# EAGLE design double_layer (EAGLE 8.1.0)
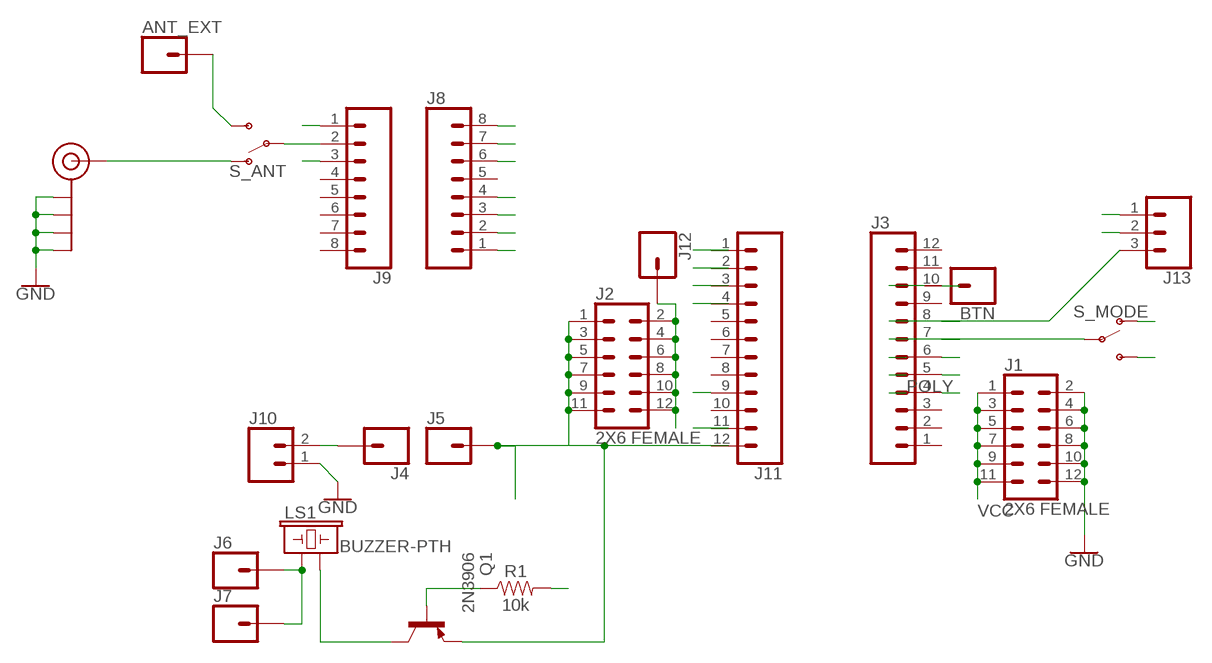
[diagram p0: schematic, sheet 1]

## Parts
ANT_EXT  CONN_01  [1X01]
BTN  CONN_01  [1X01]
J1  2X6 FEMALE  CONN_06X2PTH_FEMALE  [2X6]
J2  2X6 FEMALE  CONN_06X2PTH_FEMALE  [2X6]
J3  CONN_12  [1X12]
J4  CONN_01  [1X01]
J5  CONN_01  [1X01]
J6  CONN_01  [1X01]
J7  CONN_01  [1X01]
J8  CONN_08"  [1X08]
J9  CONN_08"  [1X08]
J10  CONN_02JST-PTH-2  [JST-2-PTH]
J11  CONN_12  [1X12]
J12  CONN_01  [1X01]
J13  CONN_03JST-PTH  [JST-3-PTH]
J$1  SMA_EDGE  [SMA-EDGE]
LS1  BUZZER-PTH  [BUZZER-12MM]
Q1  2N3906  [TO92]
R1  10k  10KOHM-HORIZ-1/6W-5%  [AXIAL-0.3]
S_ANT  SWITCH-SPDT-PTH-11.6X4.0MM  [SWITCH_SPDT_PTH_11.6X4.0MM]
S_MODE  SWITCH-SPDT-PTH-11.6X4.0MM  [SWITCH_SPDT_PTH_11.6X4.0MM]

## Nets
7: J3.7 S_MODE.2(P)
8: J3.8
10: BTN.1 J3.10
ANT: J9.2 S_ANT.2(P)
DIO0: J3.5 J8.6
GND: J1.2 J1.4 J1.6 J1.8 J1.10 J1.12 J2.2 J2.4 J2.6 J2.8 J2.10 J2.12 J3.4 J8.7 J9.1 J9.3 J10.1 J11.11 J12.1 J13.2 J$1.GND@0(GND) J$1.GND@1(GND) J$1.GND@2(GND) J$1.GND@3(GND) S_MODE.3(S)
MISO: J8.1 J11.3
MOSI: J8.2 J11.2
N$1: LS1.- Q1.1(C)
N$6: Q1.2(B) R1.P$1
N$7: ANT_EXT.1 S_ANT.3(S)
N$8: J$1.SIG(SIGNAL) S_ANT.1(O)
N$10: J4.1 J10.2
N$11: J6.1 J7.1 LS1.+
NSS: J8.4 J11.1
RAW: J2.1 J2.3 J2.5 J2.7 J2.9 J2.11 J5.1 J11.12 Q1.3(E)
SCK: J8.3 J11.4
SPKR: J3.6 R1.P$2
VCC: J1.1 J1.3 J1.5 J1.7 J1.9 J1.11 J8.8 J11.9 J13.1 S_MODE.1(O)
Unconnected: J3.1 J3.2 J3.3 J3.9 J3.11 J3.12 J8.5 J9.4 J9.5 J9.6 J9.7 J9.8 J11.5 J11.6 J11.7 J11.8 J11.10 J13.3

## Library data of the parts
ANT_EXT BTN J4-J7 J12 = SparkFun-Connectors:CONN_01: Single connection point. Often used as Generic Header-pin footprint for 0.1 inch spaced/style header connections On any of the 0.1 inch spaced packages, you can populate with these: Break Away Headers - Straight <https://www.sparkfun.com/products/116> (PRT-00116) Break Away Male Headers - Right Angle <https://www.sparkfun.com/products/553> (PRT-00553) Female Headers <https://www.sparkfun.com/products/115> (PRT-00115) Break Away Headers - Machine Pin <https://www.sparkfun.com/products/117> (PRT-00117) Break Away Female Headers - Swiss Machine Pin <https://www.sparkfun.com/products/743> (PRT-00743) This device is also useful as a general connection point to wire up your design to another part of your project. Our various solder wires solder well into these plated through hole pads. Hook-Up Wire - Assortment (Stranded, 22 AWG) <https://www.sparkfun.com/products/11375> (PRT-11375) Hook-Up Wire - Assortment (Solid Core, 22 AWG) <https://www.sparkfun.com/products/11367> (PRT-11367) View the entire wire category on our website here <https://www.sparkfun.com/categories/141> Special notes: SMTSO-256-ET is a "flush mount" nut for a 4-40 screw. We mostly use this on specialty testbeds; it is a nice way to connect hardware to your PCB at an adjustable hieght. Also note, the SNAP packages are for using a snappable style connector. We sell a baggie of snaps and they are also used on two LilyPad designs: Snap Assortment - 30 pack (male and female) <https://www.sparkfun.com/products/11347> (DEV-11347) LilyPad Arduino SimpleSnap <https://www.sparkfun.com/products/10941> (DEV-10941) LilyPad SimpleSnap Protoboard <https://www.sparkfun.com/products/10940> (DEV-10940)
J1 J2 = SparkFun-Connectors:CONN_06X2: Multi connection point. Often used as Generic Header-pin footprint for 0.1 inch spaced/style header connections On any of the 0.1 inch spaced packages, you can populate with these: Break Away Headers - Straight <https://www.sparkfun.com/products/116> (PRT-00116) Break Away Male Headers - Right Angle <https://www.sparkfun.com/products/553> (PRT-00553) Female Headers <https://www.sparkfun.com/products/115> (PRT-00115) Break Away Headers - Machine Pin <https://www.sparkfun.com/products/117> (PRT-00117) Break Away Female Headers - Swiss Machine Pin <https://www.sparkfun.com/products/743> (PRT-00743); PROD_ID: CONN-12423
J3 J11 = SparkFun-Connectors:CONN_12: Multi connection point. Often used as Generic Header-pin footprint for 0.1 inch spaced/style header connections On any of the 0.1 inch spaced packages, you can populate with these: Break Away Headers - Straight <https://www.sparkfun.com/products/116> (PRT-00116) Break Away Male Headers - Right Angle <https://www.sparkfun.com/products/553> (PRT-00553) Female Headers <https://www.sparkfun.com/products/115> (PRT-00115) Break Away Headers - Machine Pin <https://www.sparkfun.com/products/117> (PRT-00117) Break Away Female Headers - Swiss Machine Pin <https://www.sparkfun.com/products/743> (PRT-00743) For SCREWTERMINALS and SPRING TERMINALS visit here: Screw Terimnals on SparkFun.com <https://www.sparkfun.com/search/results?term=Screw+Terminals> (5mm/3.5mm/2.54mm spacing) This device is also useful as a general connection point to wire up your design to another part of your project. Our various solder wires solder well into these plated through hole pads. Hook-Up Wire - Assortment (Stranded, 22 AWG) <https://www.sparkfun.com/products/11375> (PRT-11375) Hook-Up Wire - Assortment (Solid Core, 22 AWG) <https://www.sparkfun.com/products/11367> (PRT-11367) View the entire wire category on our website here <https://www.sparkfun.com/categories/141> Special notes: Molex polarized connector foot print use with SKU : PRT-08231 with associated crimp pins and housings. 1MM SMD Version SKU: PRT-10208 NOTES ON THE VARIANTS LOCK and LOCK_LONGPADS... This footprint was designed to help hold the alignment of a through-hole component (i.e. 6-pin header) while soldering it into place. You may notice that each hole has been shifted either up or down by 0.005 of an inch from it's more standard position (which is a perfectly straight line). This slight alteration caused the pins (the squares in the middle) to touch the edges of the holes. Because they are alternating, it causes a "brace" to hold the component in place. 0.005 has proven to be the perfect amount of "off-center" position when using our standard breakaway headers. Although looks a little odd when you look at the bare footprint, once you have a header in there, the alteration is very hard to notice. Also,if you push a header all the way into place, it is covered up entirely on the bottom side.
J8 J9 = SparkFun-Connectors:CONN_08: Multi connection point. Often used as Generic Header-pin footprint for 0.1 inch spaced/style header connections On any of the 0.1 inch spaced packages, you can populate with these: Break Away Headers - Straight <https://www.sparkfun.com/products/116> (PRT-00116) Break Away Male Headers - Right Angle <https://www.sparkfun.com/products/553> (PRT-00553) Female Headers <https://www.sparkfun.com/products/115> (PRT-00115) Break Away Headers - Machine Pin <https://www.sparkfun.com/products/117> (PRT-00117) Break Away Female Headers - Swiss Machine Pin <https://www.sparkfun.com/products/743> (PRT-00743) Arduino Stackable Header - 8 Pin <https://www.sparkfun.com/products/9279> (PRT-09279) For SCREWTERMINALS and SPRING TERMINALS visit here: Screw Terimnals on SparkFun.com <https://www.sparkfun.com/search/results?term=Screw+Terminals> (5mm/3.5mm/2.54mm spacing) This device is also useful as a general connection point to wire up your design to another part of your project. Our various solder wires solder well into these plated through hole pads. Hook-Up Wire - Assortment (Stranded, 22 AWG) <https://www.sparkfun.com/products/11375> (PRT-11375) Hook-Up Wire - Assortment (Solid Core, 22 AWG) <https://www.sparkfun.com/products/11367> (PRT-11367) View the entire wire category on our website here <https://www.sparkfun.com/categories/141> Special notes: Molex polarized connector foot print use with SKU : PRT-08231 with associated crimp pins and housings. 1MM SMD Version SKU: PRT-10208 NOTES ON THE VARIANTS LOCK and LOCK_LONGPADS... This footprint was designed to help hold the alignment of a through-hole component (i.e. 6-pin header) while soldering it into place. You may notice that each hole has been shifted either up or down by 0.005 of an inch from it's more standard position (which is a perfectly straight line). This slight alteration caused the pins (the squares in the middle) to touch the edges of the holes. Because they are alternating, it causes a "brace" to hold the component in place. 0.005 has proven to be the perfect amount of "off-center" position when using our standard breakaway headers. Although looks a little odd when you look at the bare footprint, once you have a header in there, the alteration is very hard to notice. Also,if you push a header all the way into place, it is covered up entirely on the bottom side.; PROD_ID: CONN-08438
J10 = SparkFun-Connectors:CONN_02: Multi connection point. Often used as Generic Header-pin footprint for 0.1 inch spaced/style header connections On any of the 0.1 inch spaced packages, you can populate with these: Break Away Headers - Straight <https://www.sparkfun.com/products/116> (PRT-00116) Break Away Male Headers - Right Angle <https://www.sparkfun.com/products/553> (PRT-00553) Female Headers <https://www.sparkfun.com/products/115> (PRT-00115) Break Away Headers - Machine Pin <https://www.sparkfun.com/products/117> (PRT-00117) Break Away Female Headers - Swiss Machine Pin <https://www.sparkfun.com/products/743> (PRT-00743) For SCREWTERMINALS and SPRING TERMINALS visit here: Screw Terimnals on SparkFun.com <https://www.sparkfun.com/search/results?term=Screw+Terminals> (5mm/3.5mm/2.54mm spacing) This device is also useful as a general connection point to wire up your design to another part of your project. Our various solder wires solder well into these plated through hole pads. Hook-Up Wire - Assortment (Stranded, 22 AWG) <https://www.sparkfun.com/products/11375> (PRT-11375) Hook-Up Wire - Assortment (Solid Core, 22 AWG) <https://www.sparkfun.com/products/11367> (PRT-11367) View the entire wire category on our website here <https://www.sparkfun.com/categories/141> Special notes: Molex polarized connector foot print use with: PRT-08233 with associated crimp pins and housings. 2.54_SCREWTERM for use with PRT-10571. 3.5mm Screw Terminal footprints for PRT-08084 5mm Screw Terminal footprints for use with PRT-08432; PROD_ID: CONN-09863; SKU: PRT-09914
J13 = SparkFun-Connectors:CONN_03: Multi connection point. Often used as Generic Header-pin footprint for 0.1 inch spaced/style header connections On any of the 0.1 inch spaced packages, you can populate with these: Break Away Headers - Straight <https://www.sparkfun.com/products/116> (PRT-00116) Break Away Male Headers - Right Angle <https://www.sparkfun.com/products/553> (PRT-00553) Female Headers <https://www.sparkfun.com/products/115> (PRT-00115) Break Away Headers - Machine Pin <https://www.sparkfun.com/products/117> (PRT-00117) Break Away Female Headers - Swiss Machine Pin <https://www.sparkfun.com/products/743> (PRT-00743) Stackable Header - 3 Pin (Female, 0.1") <https://www.sparkfun.com/products/13875> (PRT-13875) For SCREWTERMINALS and SPRING TERMINALS visit here: Screw Terimnals on SparkFun.com <https://www.sparkfun.com/search/results?term=Screw+Terminals> (5mm/3.5mm/2.54mm spacing) This device is also useful as a general connection point to wire up your design to another part of your project. Our various solder wires solder well into these plated through hole pads. Hook-Up Wire - Assortment (Stranded, 22 AWG) <https://www.sparkfun.com/products/11375> (PRT-11375) Hook-Up Wire - Assortment (Solid Core, 22 AWG) <https://www.sparkfun.com/products/11367> (PRT-11367) View the entire wire category on our website here <https://www.sparkfun.com/categories/141> Special notes: Molex polarized connector foot print use with SKU : PRT-08232 with associated crimp pins and housings.; PROD_ID: WIRE-10037; SF_ID: PRT-09915
J$1 = SparkFun-Retired:SMA_EDGE: SMA Antenna Connector End launch SMA connector. The paste layer has been removed so that the connector can be hand soldered onto the board after reflow.
LS1 = SparkFun-Electromechanical:BUZZER: Buzzer Small round buzzers that operate around the audible 2kHz range. You can use these as speakers to create simple music or user interfaces. Variant Overview: PTH - Mini Speaker - PC Mount 12mm 2.048kHz <https://www.sparkfun.com/products/7950> PTH_KIT - Mini Speaker - PC Mount 12mm 2.048kHz <https://www.sparkfun.com/products/7950> KIT simplifies soldering by adding stop mask to one side of the pads. PTH_NO_SILK - Mini Speaker - PC Mount 12mm 2.048kHz <https://www.sparkfun.com/products/7950> No silkscreen indicator of buzzer outline. PTH_KIT_NO_SILK - Mini Speaker - PC Mount 12mm 2.048kHz <https://www.sparkfun.com/products/7950> KIT package w/o silkscreen SMD - Buzzer Audio Magnetic (CCV-084B16) SMD buzzer used on, e.g. the LilyPad Buzzer <https://www.sparkfun.com/products/8463> and RFID USB Reader <https://www.sparkfun.com/products/9963>. SMD_KIT - Buzzer Audio Magnetic (CCV-084B16) SMD Buzzer with elongated pins to make soldering easier. Used on the SparkFun Simon Says - Surface Mount Soldering Kit <https://www.sparkfun.com/products/10935>.; PROD_ID: COMP-08253; SF_SKU: COM-07950
Q1 = transistor-pnp:2N3906: PNP Transistor
R1 = SparkFun-Resistors:10KOHM: 10kΩ resistor A resistor is a passive two-terminal electrical component that implements electrical resistance as a circuit element. Resistors act to reduce current flow, and, at the same time, act to lower voltage levels within circuits. - Wikipedia; PROD_ID: RES-08375
S_ANT S_MODE = SparkFun-Switches:SWITCH-SPDT: Single Pole, Double Throw (SPDT) Switch Single-pole, double-throw (SPDT) switch. Variant Overview SMD-AYZ0202 Surface Mount DPDT Switch <https://www.sparkfun.com/products/597> (COM-00597) Used on e.g. LilyPad Arduino USB - ATmega32U4 Board <https://www.sparkfun.com/products/12049> PTH-11.6X4.0MM SPDT Mini Power Switch <https://www.sparkfun.com/products/102> (COM-00102) Used on e.g. SparkFun Simon Says - Through-Hole Soldering Kit <https://www.sparkfun.com/products/10547> (KIT-10547) PTH-11.6X4.0MM-KIT KIT version of SPDT Mini Power Switch - Simplifies soldering by removing tStop of switch pins - only one side can be soldered. PTH-11.6X4.0MM-LOCK LOCK version of SPDT Mini Power Switch - Offset pins hold switch in place for easier soldering. SMD-RIGHT-ANGLE Surface Mount Right Angle Switch <https://www.sparkfun.com/products/10860> (COM-10860) Used on e.g. SparkFun ESP8266 Thing <https://www.sparkfun.com/products/13231>; PROD_ID: SWCH-08261; SF_SKU: COM-00102

## Board
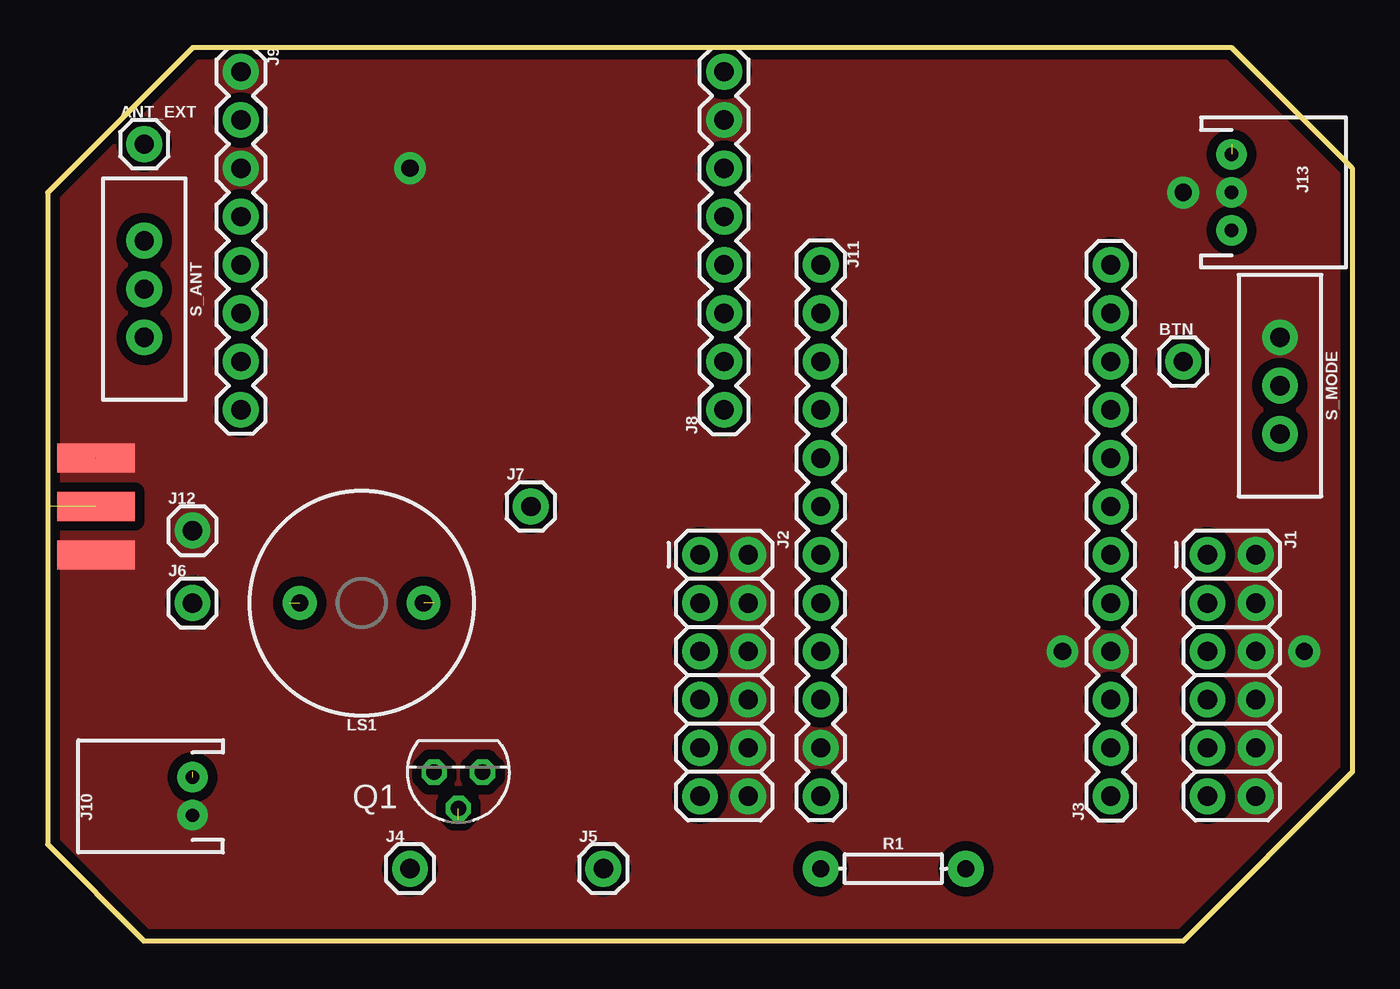
[diagram p1: board, top side]
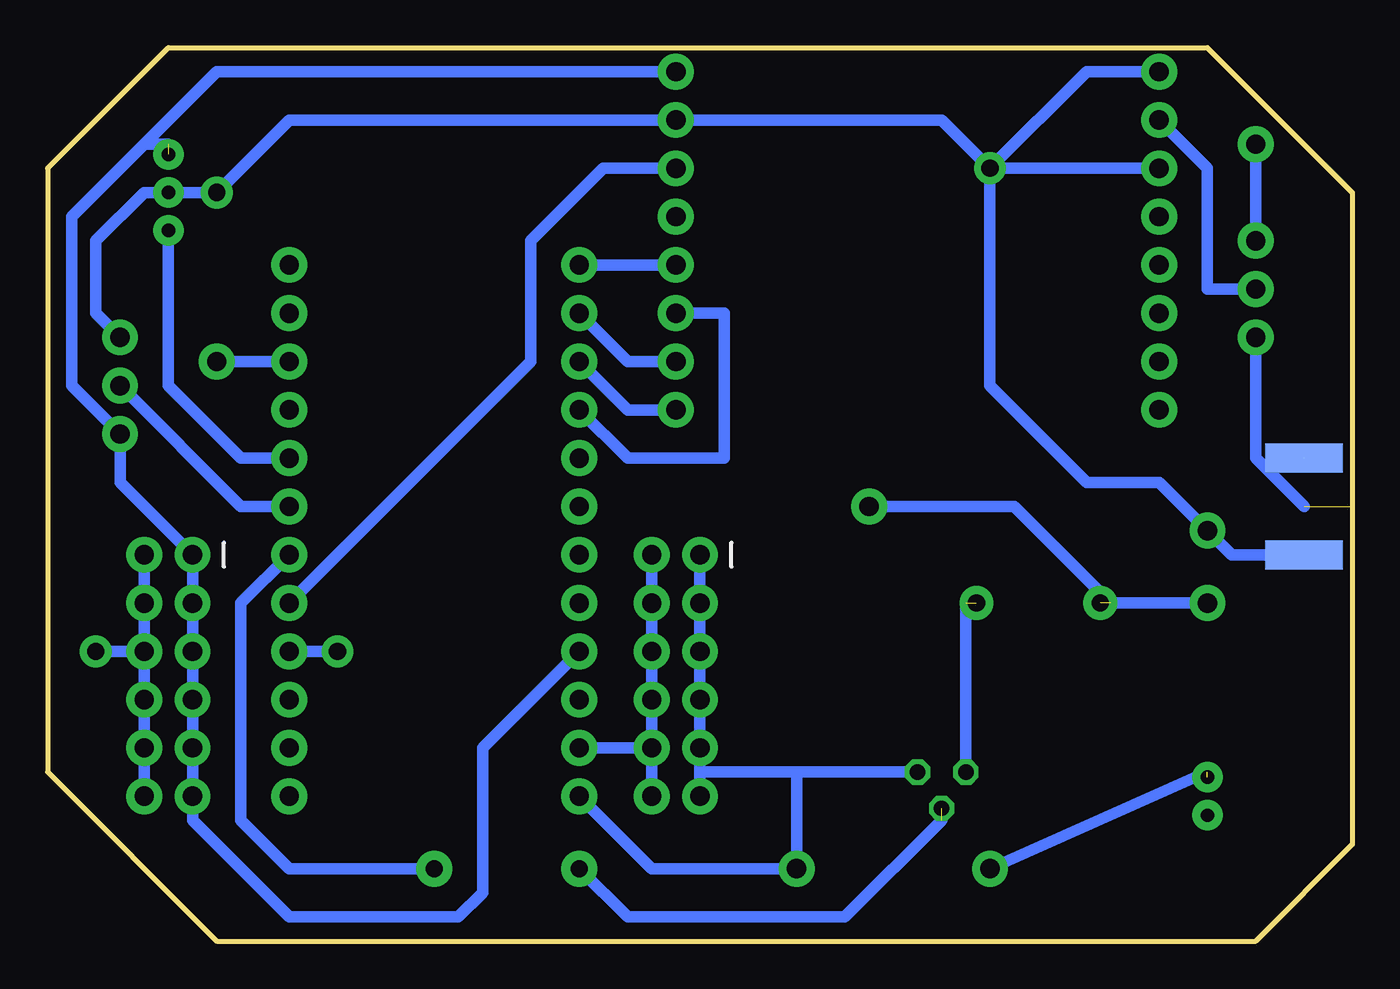
[diagram p2: board, bottom side, seen from below]

Size 68.58 x 46.99 mm. Coordinates in mm from the lower left corner, seen from the top.
Outline: 68.58,8.89 59.69,0 5.08,0 0,5.08 0,39.37 7.62,46.99 62.23,46.99 68.58,40.64 68.58,8.89
Copper layers (1*16): Top 0.035mm / dielectric 1.5mm / Bottom 0.035mm
Design rules "default *": minimum track width 10mil, minimum drill 24mil, track to track 8mil, track to pad 8mil, pad to pad 8mil, via to via 8mil, smd to smd 8mil, copper to edge 10mil, drill to drill 8mil, minimum pad ring 10mil, minimum via ring 8mil, stop-mask expansion 4mil, vias tented up to drill 0mil, thermal gap 10mil

### Footprints (pad centres in the part's own frame; a part is rotated, then mirrored left to right if it is on the bottom)
1X01 = drill 1.016 pad 1.88: 1 0,0
2X6 = drill 1.016 pad 1.88: 1 0,0; 2 0,2.54; 3 2.54,0; 4 2.54,2.54; 5 5.08,0; 6 5.08,2.54; 7 7.62,0; 8 7.62,2.54; 9 10.16,0; 10 10.16,2.54; 11 12.7,0; 12 12.7,2.54
1X12 = drill 1.016 pad 1.88: 1 0,0; 2 2.54,0; 3 5.08,0; 4 7.62,0; 5 10.16,0; 6 12.7,0; 7 15.24,0; 8 17.78,0; 9 20.32,0; 10 22.86,0; 11 25.4,0; 12 27.94,0
1X08 = drill 1.016 pad 1.88: 1 0,0; 2 2.54,0; 3 5.08,0; 4 7.62,0; 5 10.16,0; 6 12.7,0; 7 15.24,0; 8 17.78,0
JST-2-PTH = drill 0.7 pad 1.6: 1 -1,0; 2 1,0
JST-3-PTH = drill 0.7 pad 1.6: 1 -2,0; 2 0,0; 3 2,0
SMA-EDGE = smd 1.524 x 4.064: GND@0 0,0; GND@1 5.08,0; SIG 2.54,0 | smd 1.524 x 4.064 bottom: GND@2 0,0; GND@3 5.08,0
BUZZER-12MM = drill 0.9 pad 1.778: + 3.25,0; - -3.25,0
TO92 = drill 0.813 octagon: 1 1.27,0; 2 0,1.905; 3 -1.27,0
AXIAL-0.3 = drill 0.9 pad 1.88: P$1 -3.81,0; P$2 3.81,0
SWITCH_SPDT_PTH_11.6X4.0MM = drill 1.016 pad 1.88: 1 0,2.54; 2 0,0; 3 0,-2.54

### Placement (x,y rotation side)
ANT_EXT  5.08,41.91 0 top
BTN  59.69,30.48 0 top
J1  60.96,20.32 270 top
J2  34.29,20.32 270 top
J3  55.88,7.62 90 top
J4  19.05,3.81 0 top
J5  29.21,3.81 0 top
J6  7.62,17.78 0 top
J7  25.4,22.86 0 top
J8  35.56,27.94 90 top
J9  10.16,45.72 270 top
J10  7.62,7.62 90 top
J11  40.64,35.56 270 top
J12  7.62,21.59 0 top
J13  62.23,39.37 270 top
J$1  2.54,20.32 90 top
LS1  16.51,17.78 180 top
Q1  21.59,8.89 180 top
R1  44.45,3.81 0 top
S_ANT  5.08,34.29 180 top
S_MODE  64.77,29.21 180 top

### Tracks (layer width: path | path; a pad name or v marks a point on that pad's centre or on a via)
7
  Bottom 0.61: J3.7 58.42,22.86 S_MODE.2
8
  Bottom 0.61: J3.8 58.42,25.4 62.23,29.21 62.23,36.83
10
  Bottom 0.61: J3.10 BTN.1
ANT
  Bottom 0.61: J9.2 7.62,40.64 7.62,34.29 S_ANT.2
DIO0
  Bottom 0.61: J8.6 39.37,40.64 43.18,36.83 43.18,30.48 J3.5
GND  (via drill 0.9 pad 1.68)  (1 unrouted)
  Bottom 0.61: S_MODE.3 66.04,33.02 66.04,36.83 63.5,39.37 J13.2 v59.69,39.37 55.88,43.18 J8.7 21.59,43.18 v19.05,40.64 | J1.6 J1.4 J1.2 J1.6 | J9.1 13.97,45.72 v19.05,40.64 | v19.05,40.64 J9.3 | J1.12 J1.6 | v19.05,40.64 19.05,29.21 13.97,24.13 10.16,24.13 J12.1 6.35,20.32 J$1.GND@0 | J3.4 v53.34,15.24 | J1.6 v66.04,15.24 | J2.2 J2.4 J2.6 J2.8 J2.10 | J2.10 J2.12 | J11.11 J2.10
  pour Top (isolate 0.508, no thermals): 0,39.37 0,5.08 5.08,0 59.69,0 68.58,8.89 68.58,40.64 62.23,46.99 7.62,46.99
MISO
  Bottom 0.61: J8.1 38.1,27.94 J11.3
MOSI
  Bottom 0.61: J8.2 38.1,30.48 J11.2
N$1  (1 unrouted)
  Bottom 0.61: Q1.1 20.32,17.78
N$6  (1 unrouted)
  Bottom 0.61: 21.59,6.35 26.67,1.27 38.1,1.27 R1.P$1
N$7
  Bottom 0.61: S_ANT.3 ANT_EXT.1
N$8  (2 unrouted)
  Bottom 0.61: S_ANT.1 5.08,25.4 J$1.SIG
N$10  (1 unrouted)
  Bottom 0.61: 7.62,8.89 J4.1
N$11  (1 unrouted)
  Bottom 0.61: J6.1 12.7,17.78 17.78,22.86 J7.1
NSS
  Bottom 0.61: J8.4 J11.1
RAW
  Bottom 0.61: J2.11 34.29,8.89 | 34.29,8.89 J2.9 J2.7 J2.5 J2.3 J2.1 | J11.12 36.83,3.81 J5.1 29.21,8.89 | Q1.3 29.21,8.89 | 29.21,8.89 34.29,8.89
SCK
  Bottom 0.61: J8.3 33.02,33.02 33.02,25.4 38.1,25.4 J11.4
SPKR
  Bottom 0.61: R1.P$2 55.88,3.81 58.42,6.35 58.42,17.78 J3.6
VCC  (1 unrouted)
  Bottom 0.61: J11.9 45.72,10.16 45.72,2.54 46.99,1.27 55.88,1.27 60.96,6.35 J1.11 J1.9 J1.7 J1.5 J1.3 J1.1 64.77,24.13 S_MODE.1 67.31,29.21 67.31,38.1 63.5,41.91 | J8.8 59.69,45.72 63.5,41.91 | 62.23,41.91 63.5,41.91